# EAGLE design PWM_Regulator (EAGLE 7.2.0)
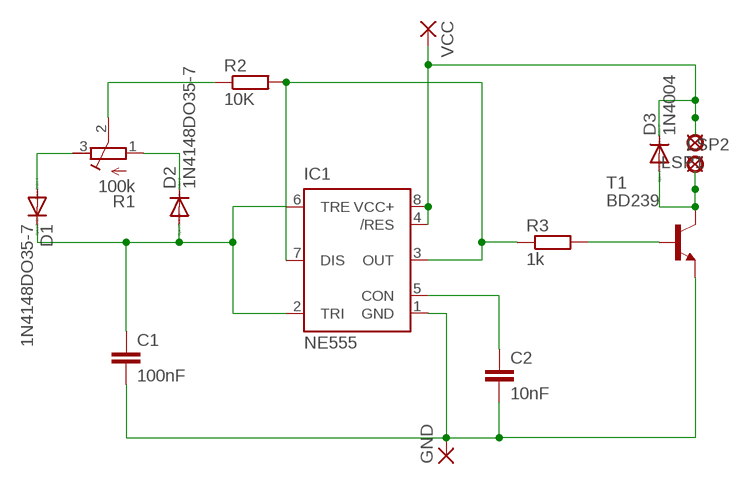
[diagram p0: schematic, sheet 1]

## Parts
C1  100nF  C-EU050-024X044  [C050-024X044]
C2  10nF  C-EU050-024X044  [C050-024X044]
D1  1N4148DO35-7  [DO35-7]
D2  1N4148DO35-7  [DO35-7]
D3  1N4004  [DO41-10]
GND  2,54/0,8  [2,54/0,8]
IC1  NE555  [DIL-08]
LSP1  LSP10  [LSP10]
LSP2  LSP10  [LSP10]
R1  100k  R-TRIMM3339P  [RTRIM3339P]
R2  10K  R-EU_0204/7  [0204/7]
R3  1k  R-EU_0207/10  [0207/10]
T1  BD239  [TO220]
VCC  2,54/0,8  [2,54/0,8]

## Nets
N$1: D1.A R1.3(E)
N$2: D2.C R1.1(A)
N$3: C1.1 D1.C D2.A IC1.2(TRI) IC1.6(TRE)
N$5: R3.2 T1.1(B)
N$6: C2.1 IC1.5(CON)
N$7: D3.C IC1.4(/RES) IC1.8(VCC+) LSP1.MP VCC.1(P)
N$8: IC1.3(OUT) IC1.7(DIS) R2.2 R3.1
N$9: R1.2(S) R2.1
N$11: C1.2 C2.2 GND.1(P) IC1.1(GND) T1.3(E)
N$15: D3.A LSP2.MP T1.2(C)

## Library data of the parts
C1 C2 = rcl:C-EU: CAPACITOR, European symbol
D1 D2 = diode:1N4148: DIODE high speed (Philips)
D3 = diode:1N4004: DIODE general purpose rectifier, 1 A
GND VCC = wirepad:2,54/0,8: THROUGH-HOLE PAD
IC1 = st-microelectronics:NE555: General purpose bipolar Timer; MF: Arrow Electronics; MPN: NE555N; OC_FARNELL: 1467742; OC_NEWARK: 89K1486
LSP1 LSP2 = solpad:LSP10: SOLDER PAD drill 1.0 mm, distributor Buerklin, 12H555
R1 = rcl:R-TRIMM: Trimm resistor
R2 R3 = rcl:R-EU_: RESISTOR, European symbol
T1 = transistor-npn:BD239*: NPN Transistor

## Board
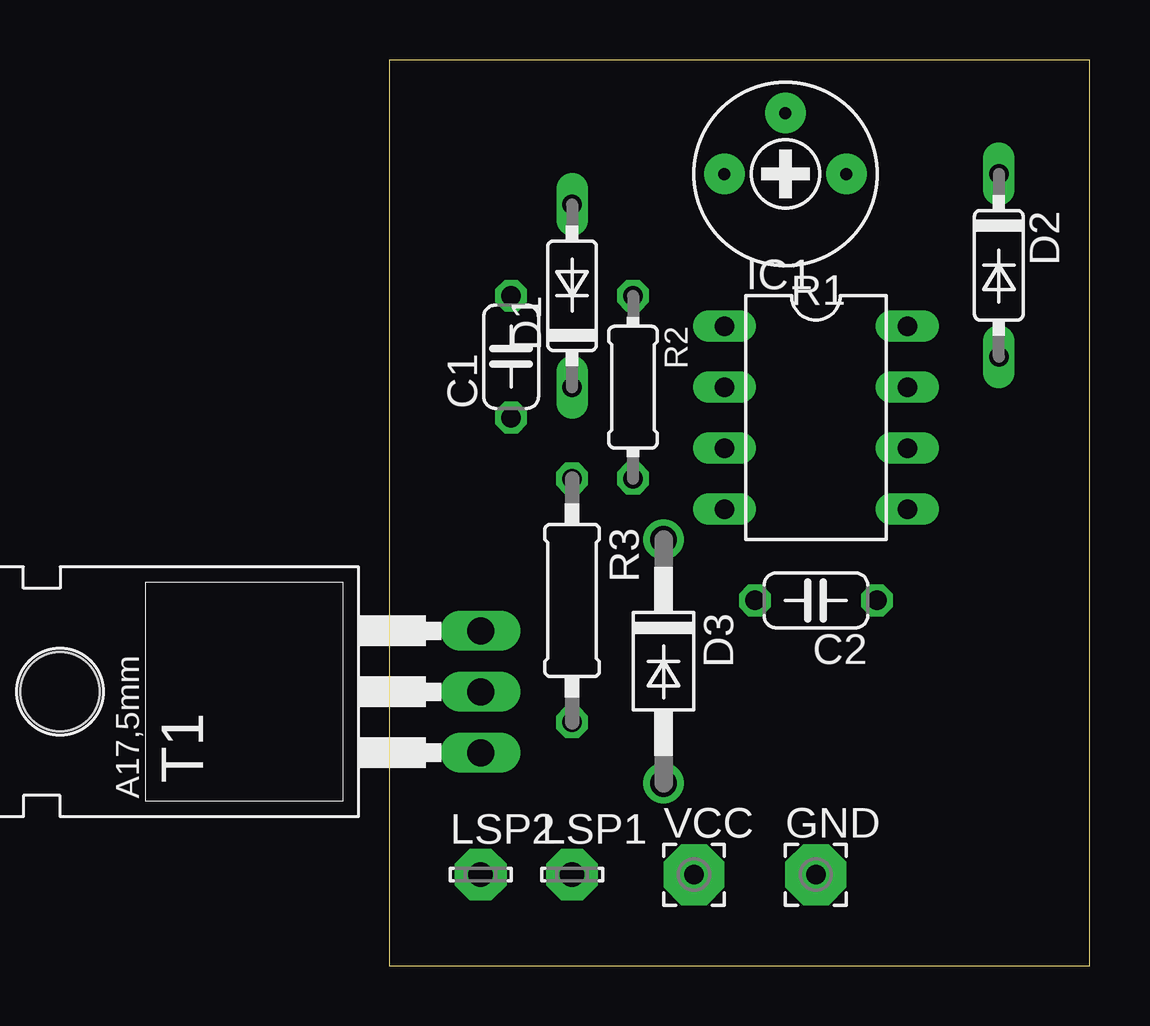
[diagram p1: board, top side]
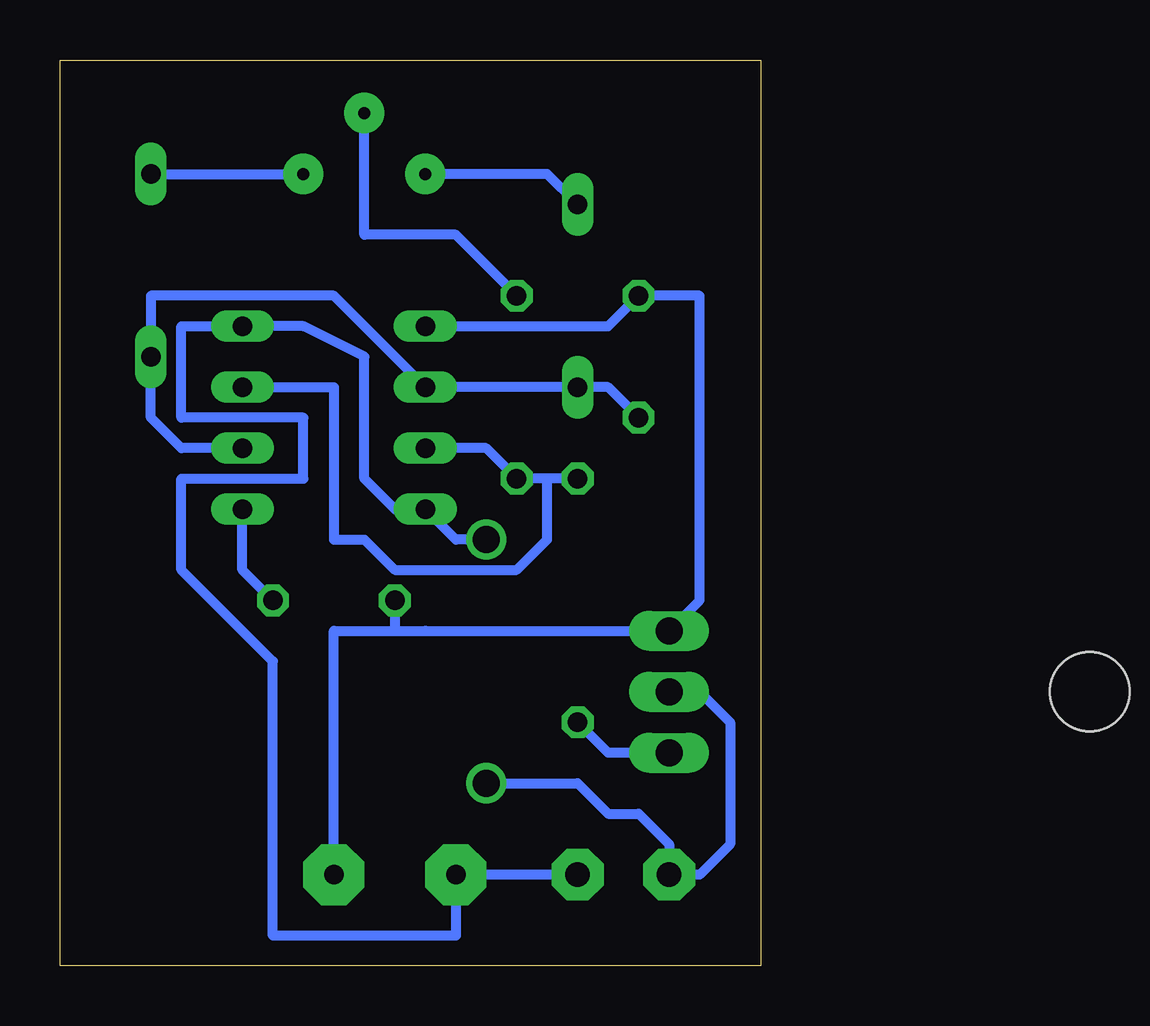
[diagram p2: board, bottom side, seen from below]

Size 29.19 x 37.77 mm. Coordinates in mm from the lower left corner, seen from the top.
Outline: 0,0 29.19,0 29.19,37.77 0,37.77 0,0
Copper layers (1*16): Top 0.035mm / dielectric 1.5mm / Bottom 0.035mm
Design rules "default": minimum track width 10mil, minimum drill 24mil, track to track 8mil, track to pad 8mil, pad to pad 8mil, via to via 8mil, smd to smd 8mil, copper to edge 40mil, drill to drill 8mil, minimum pad ring 10mil, minimum via ring 8mil, stop-mask expansion 4mil, vias tented up to drill 0mil, thermal gap 10mil

### Footprints (pad centres in the part's own frame; a part is rotated, then mirrored left to right if it is on the bottom)
C050-024X044 = drill 0.813 octagon: 1 -2.54,0; 2 2.54,0
DO35-7 = drill 0.813 long: A 3.81,0; C -3.81,0
DO41-10 = drill 1.118: A 5.08,0; C -5.08,0
2,54/0,8 = drill 0.813 pad 2.54 octagon: 1 0,0
DIL-08 = drill 0.813 long: 1 -3.81,-3.81; 2 -1.27,-3.81; 3 1.27,-3.81; 4 3.81,-3.81; 5 3.81,3.81; 6 1.27,3.81; 7 -1.27,3.81; 8 -3.81,3.81
LSP10 = drill 1.016 pad 2.159 octagon: MP 0,0
RTRIM3339P = drill 0.5 pad 1.676: 1 -2.54,0; 2 0,-2.54; 3 2.54,0
0204/7 = drill 0.813 octagon: 1 -3.81,0; 2 3.81,0
0207/10 = drill 0.813 octagon: 1 -5.08,0; 2 5.08,0
TO220 = drill 1.118 long: 1 -2.54,-6.35; 2 0,-6.35; 3 2.54,-6.35 | hole 3.302: 0,11.176

### Placement (x,y rotation side)
C1  5.08,25.4 90 top
C2  17.78,15.24 180 top
D1  7.62,27.94 90 top
D2  25.4,29.21 270 top
D3  11.43,12.7 270 top
GND  17.78,3.81 0 top
IC1  17.78,22.86 270 top
LSP1  7.62,3.81 0 top
LSP2  3.81,3.81 0 top
R1  16.51,33.02 180 top
R2  10.16,24.13 270 top
R3  7.62,15.24 270 top
T1  -2.54,11.43 90 top
VCC  12.7,3.81 0 top

### Tracks (layer width: path | path; a pad name or v marks a point on that pad's centre or on a via)
N$1
  Bottom 0.406: D1.A 8.89,33.02 R1.3
N$2
  Bottom 0.406: D2.C R1.1
N$3
  Bottom 0.406: C1.1 6.35,24.13 D1.C IC1.2 17.78,27.94 25.4,27.94 D2.A 25.4,22.86 24.13,21.59 IC1.6
N$5
  Bottom 0.406: T1.1 6.35,8.89 R3.2
N$6
  Bottom 0.406: C2.1 21.59,16.51 IC1.5
N$7
  Bottom 0.406: D3.C 12.7,17.78 IC1.4 15.24,19.05 16.51,20.32 16.51,25.4 19.05,26.67 IC1.8 24.13,26.67 24.13,22.86 19.05,22.86 19.05,20.32 24.13,20.32 24.13,16.51 20.32,12.7 20.32,1.27 12.7,1.27 VCC.1 LSP1.MP
N$8
  Bottom 0.406: R3.1 8.89,20.32 | 8.89,20.32 R2.2 11.43,21.59 IC1.3 | IC1.7 17.78,24.13 17.78,17.78 16.51,17.78 15.24,16.51 10.16,16.51 8.89,17.78 8.89,20.32
N$9
  Bottom 0.406: R2.1 12.7,30.48 16.51,30.48 R1.2
N$11
  Bottom 0.406: IC1.1 6.35,26.67 C1.2 2.54,27.94 2.54,15.24 T1.3 13.97,13.97 15.24,13.97 | C2.2 15.24,13.97 | GND.1 17.78,13.97 15.24,13.97
N$15
  Bottom 0.406: T1.2 2.54,11.43 1.27,10.16 1.27,5.08 2.54,3.81 LSP2.MP 3.81,5.08 5.08,6.35 6.35,6.35 7.62,7.62 D3.A